# EAGLE design LilyPad_Protoboard_Small (EAGLE 7.2.0)
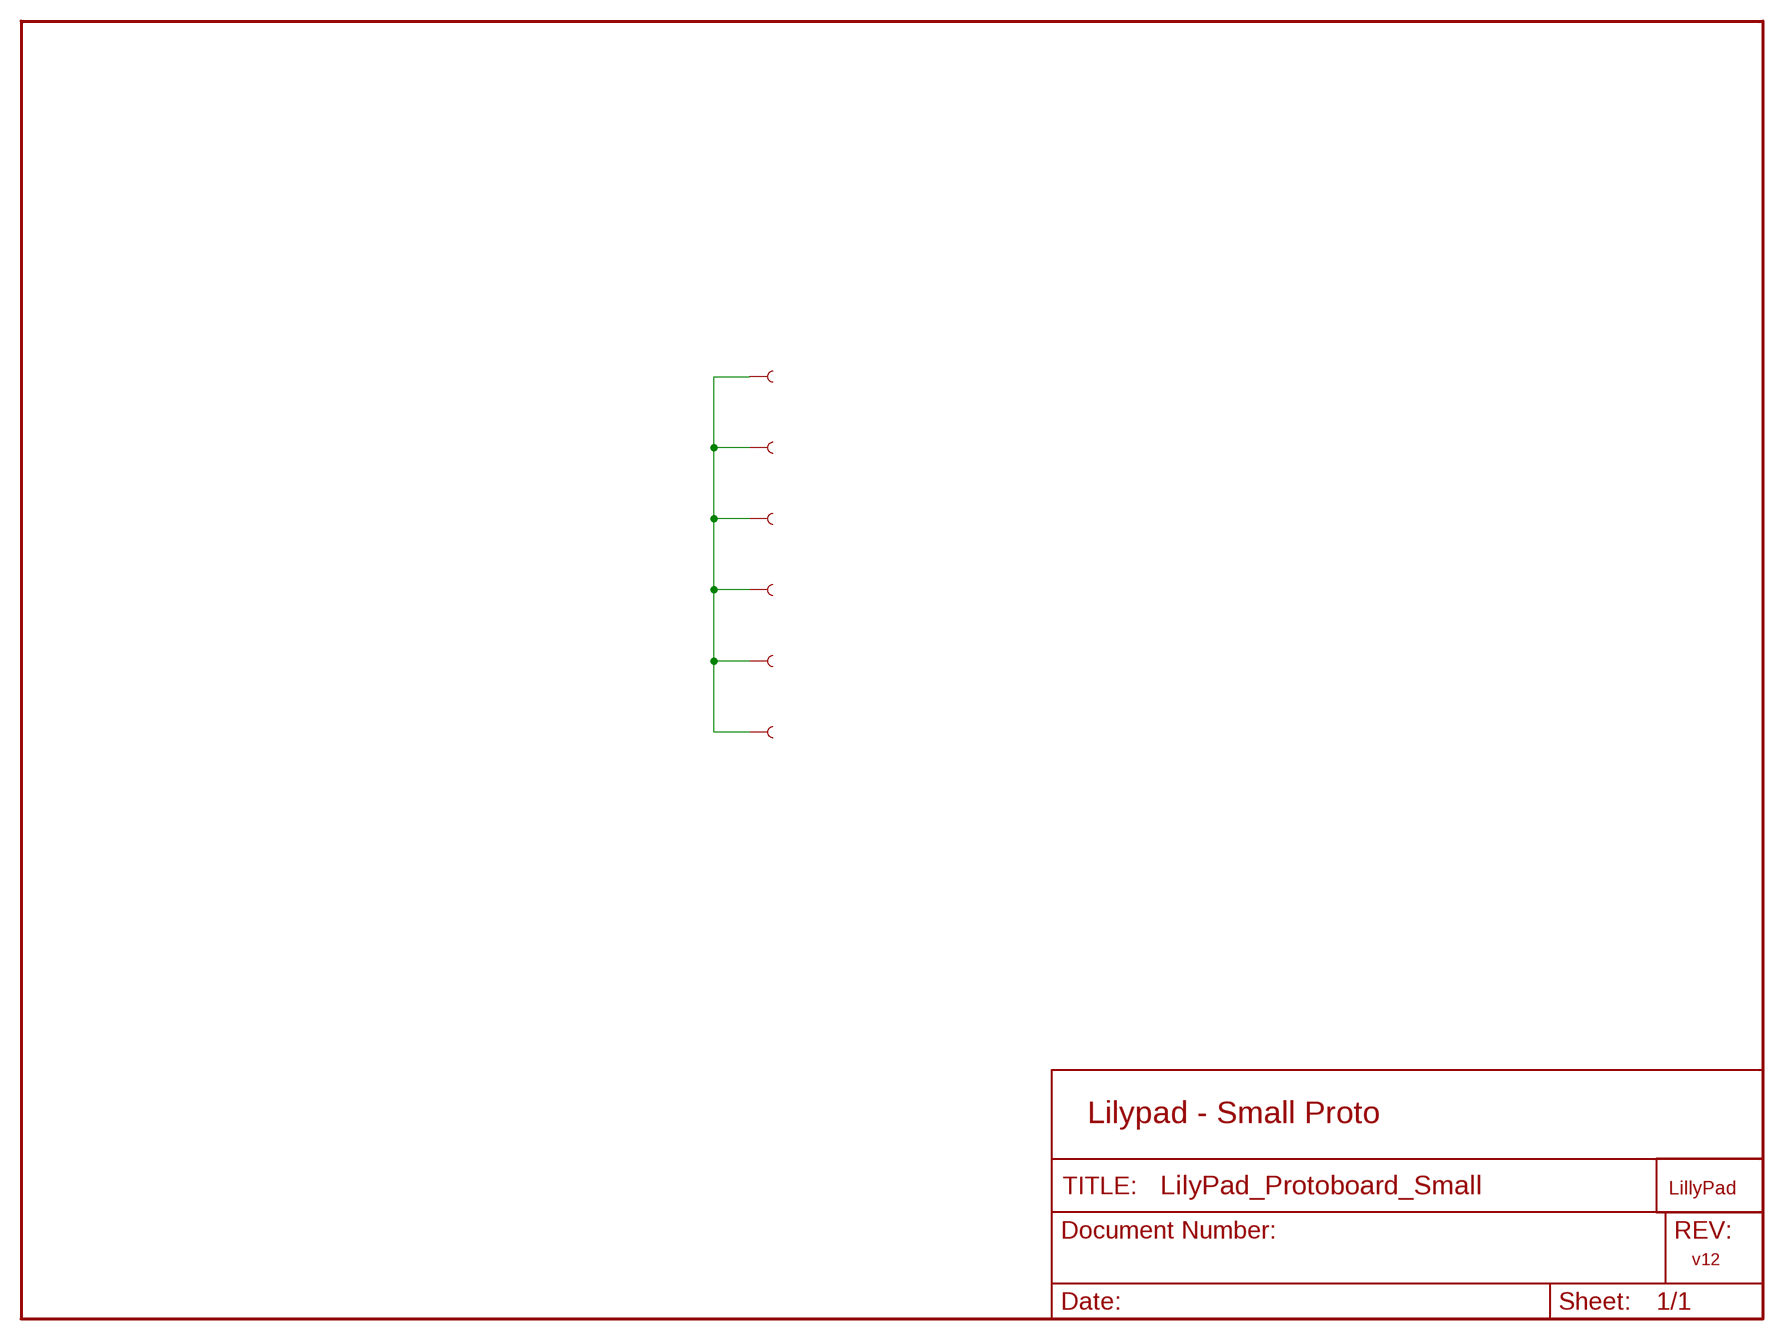
[diagram p0: schematic, sheet 1]

## Parts
U$2  LOGO-LPL  [LOGO-L]
U$3  SEWTAP6  [PETAL-SMALL-2SIDE]
U$4  SEWTAP6  [PETAL-SMALL-2SIDE]
U$5  SEWTAP6  [PETAL-SMALL-2SIDE]
U$8  SEWTAP6  [PETAL-SMALL-2SIDE]
U$9  SEWTAP6  [PETAL-SMALL-2SIDE]
U$10  SEWTAP6  [PETAL-SMALL-2SIDE]

## Nets
ALLNET: U$3.1 U$4.1 U$5.1 U$8.1 U$9.1 U$10.1

## Notes on the sheet
- Lilypad - Small Proto
- v12

## Library data of the parts
U$2 = LilyPad-Wearables:LOGO-LP
U$3-U$5 U$8-U$10 = LilyPad-Wearables:SEWTAP

## Board
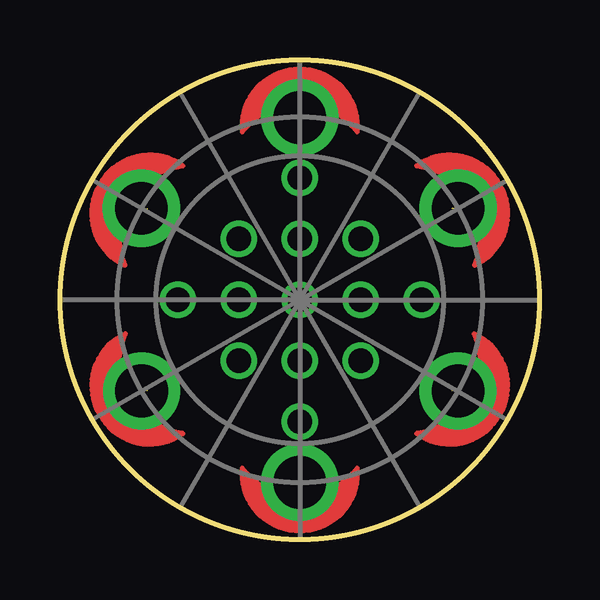
[diagram p1: board, top side]
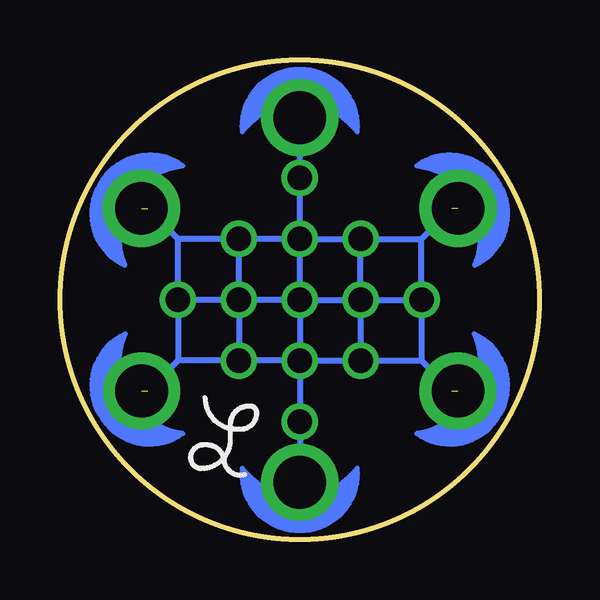
[diagram p2: board, bottom side, seen from below]

Size 20 x 20 mm. Coordinates in mm from the lower left corner, seen from the top.
Outline: circle at 10,10 radius 10
Copper layers (1*16): Top 0.035mm / dielectric 1.5mm / Bottom 0.035mm
Design rules "SparkFun": minimum track width 8mil, minimum drill 20mil, track to track 8mil, track to pad 8mil, pad to pad 8mil, via to via 8mil, smd to smd 8mil, copper to edge 8mil, drill to drill 8mil, minimum pad ring 12mil, minimum via ring 10mil, stop-mask expansion 4mil, vias tented up to drill 20mil, thermal gap 10mil

### Footprints (pad centres in the part's own frame; a part is rotated, then mirrored left to right if it is on the bottom)
PETAL-SMALL-2SIDE = drill 2.2: 1 0,0

### Placement (x,y rotation side)
U$2  13.18,4.29 0 bottom
U$3  3.4,13.81 240 top
U$4  16.6,13.81 120 top
U$5  10,2.38 0 top
U$8  3.4,6.2 300 top
U$9  16.6,6.2 60 top
U$10  10,17.6 180 top

### Tracks (layer width: path | path; a pad name or v marks a point on that pad's centre or on a via)
ALLNET  (via drill 1.02)  (4 unrouted)
  Bottom 0.254: v7.46,10 v4.92,10 | v7.46,10 v7.46,12.54 | v10,12.54 v7.46,12.54 | v10,10 v10,12.54 | v12.54,10 v12.54,12.54 | v10,12.54 v12.54,12.54 | v12.54,10 v15.08,10 | v10,7.46 v12.54,7.46 | v10,10 v10,7.46 | v7.46,10 v7.46,7.46 | v10,7.46 v7.46,7.46 | v12.54,10 v12.54,7.46 | v10,10 v7.46,10 | v10,10 v12.54,10 | v4.92,10 4.92,12.54 | v4.92,10 4.92,7.46 | v15.08,10 15.08,12.54 | v15.08,10 15.08,7.46 | v7.46,12.54 4.92,12.54 | v7.46,7.46 4.92,7.46 | v12.54,12.54 15.08,12.54 | v12.54,7.46 15.08,7.46 | 15.08,7.46 16.34,6.2 | 15.08,12.54 16.35,13.81 | 4.92,12.54 3.65,13.81 | 4.92,7.46 3.66,6.2 | v10,12.54 v10,15.08 U$10.1 | v10,7.46 v10,4.92 U$5.1